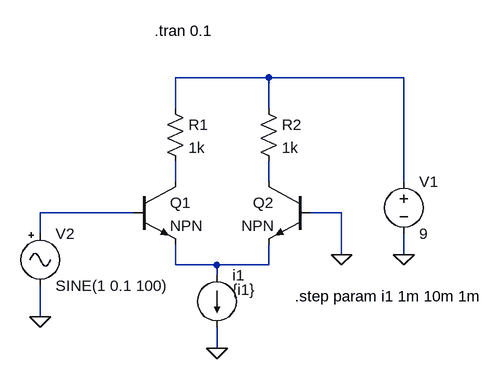
[diagram p0: schematic differential-amplifier.asc]
differential-amplifier.asc, the LTspice schematic file:
Version 4
SHEET 1 936 680
WIRE 448 128 304 128
WIRE 656 128 448 128
WIRE 304 176 304 128
WIRE 448 176 448 128
WIRE 304 288 304 256
WIRE 448 288 448 256
WIRE 656 288 656 128
WIRE 240 336 96 336
WIRE 560 336 512 336
WIRE 96 368 96 336
WIRE 560 400 560 336
WIRE 656 400 656 368
WIRE 304 416 304 384
WIRE 368 416 304 416
WIRE 448 416 448 384
WIRE 448 416 368 416
WIRE 368 432 368 416
WIRE 96 496 96 448
WIRE 368 544 368 512
FLAG 368 544 0
FLAG 656 400 0
FLAG 560 400 0
FLAG 96 496 0
SYMBOL npn 240 288 R0
SYMATTR InstName Q1
SYMBOL npn 512 288 M0
SYMATTR InstName Q2
SYMBOL current 368 432 R0
WINDOW 3 24 22 Left 2
SYMATTR Value {i1}
SYMATTR InstName i1
SYMBOL voltage 656 272 R0
SYMATTR InstName V1
SYMATTR Value 9
SYMBOL res 288 160 R0
SYMATTR InstName R1
SYMATTR Value 1k
SYMBOL res 432 160 R0
SYMATTR InstName R2
SYMATTR Value 1k
SYMBOL Misc/signal 96 352 R0
SYMATTR InstName V2
SYMATTR Value SINE(1 0.1 100)
TEXT 272 56 Left 2 !.tran 0.1
TEXT 488 464 Left 2 !.step param i1 1m 10m 1m

The netlist it stands for:
* differential-amplifier.asc
Q1 N002 N004 N005 0 NPN
Q2 N003 0 N005 0 NPN
i1 N005 0 {i1}
V1 N001 0 9
R1 N001 N002 1k
R2 N001 N003 1k
V2 N004 0 SINE(1 0.1 100)
.model NPN NPN
.model PNP PNP
.lib standard.bjt
.tran 0.1
.step param i1 1m 10m 1m
.backanno
.end